# EAGLE design controller (EAGLE 4.11)
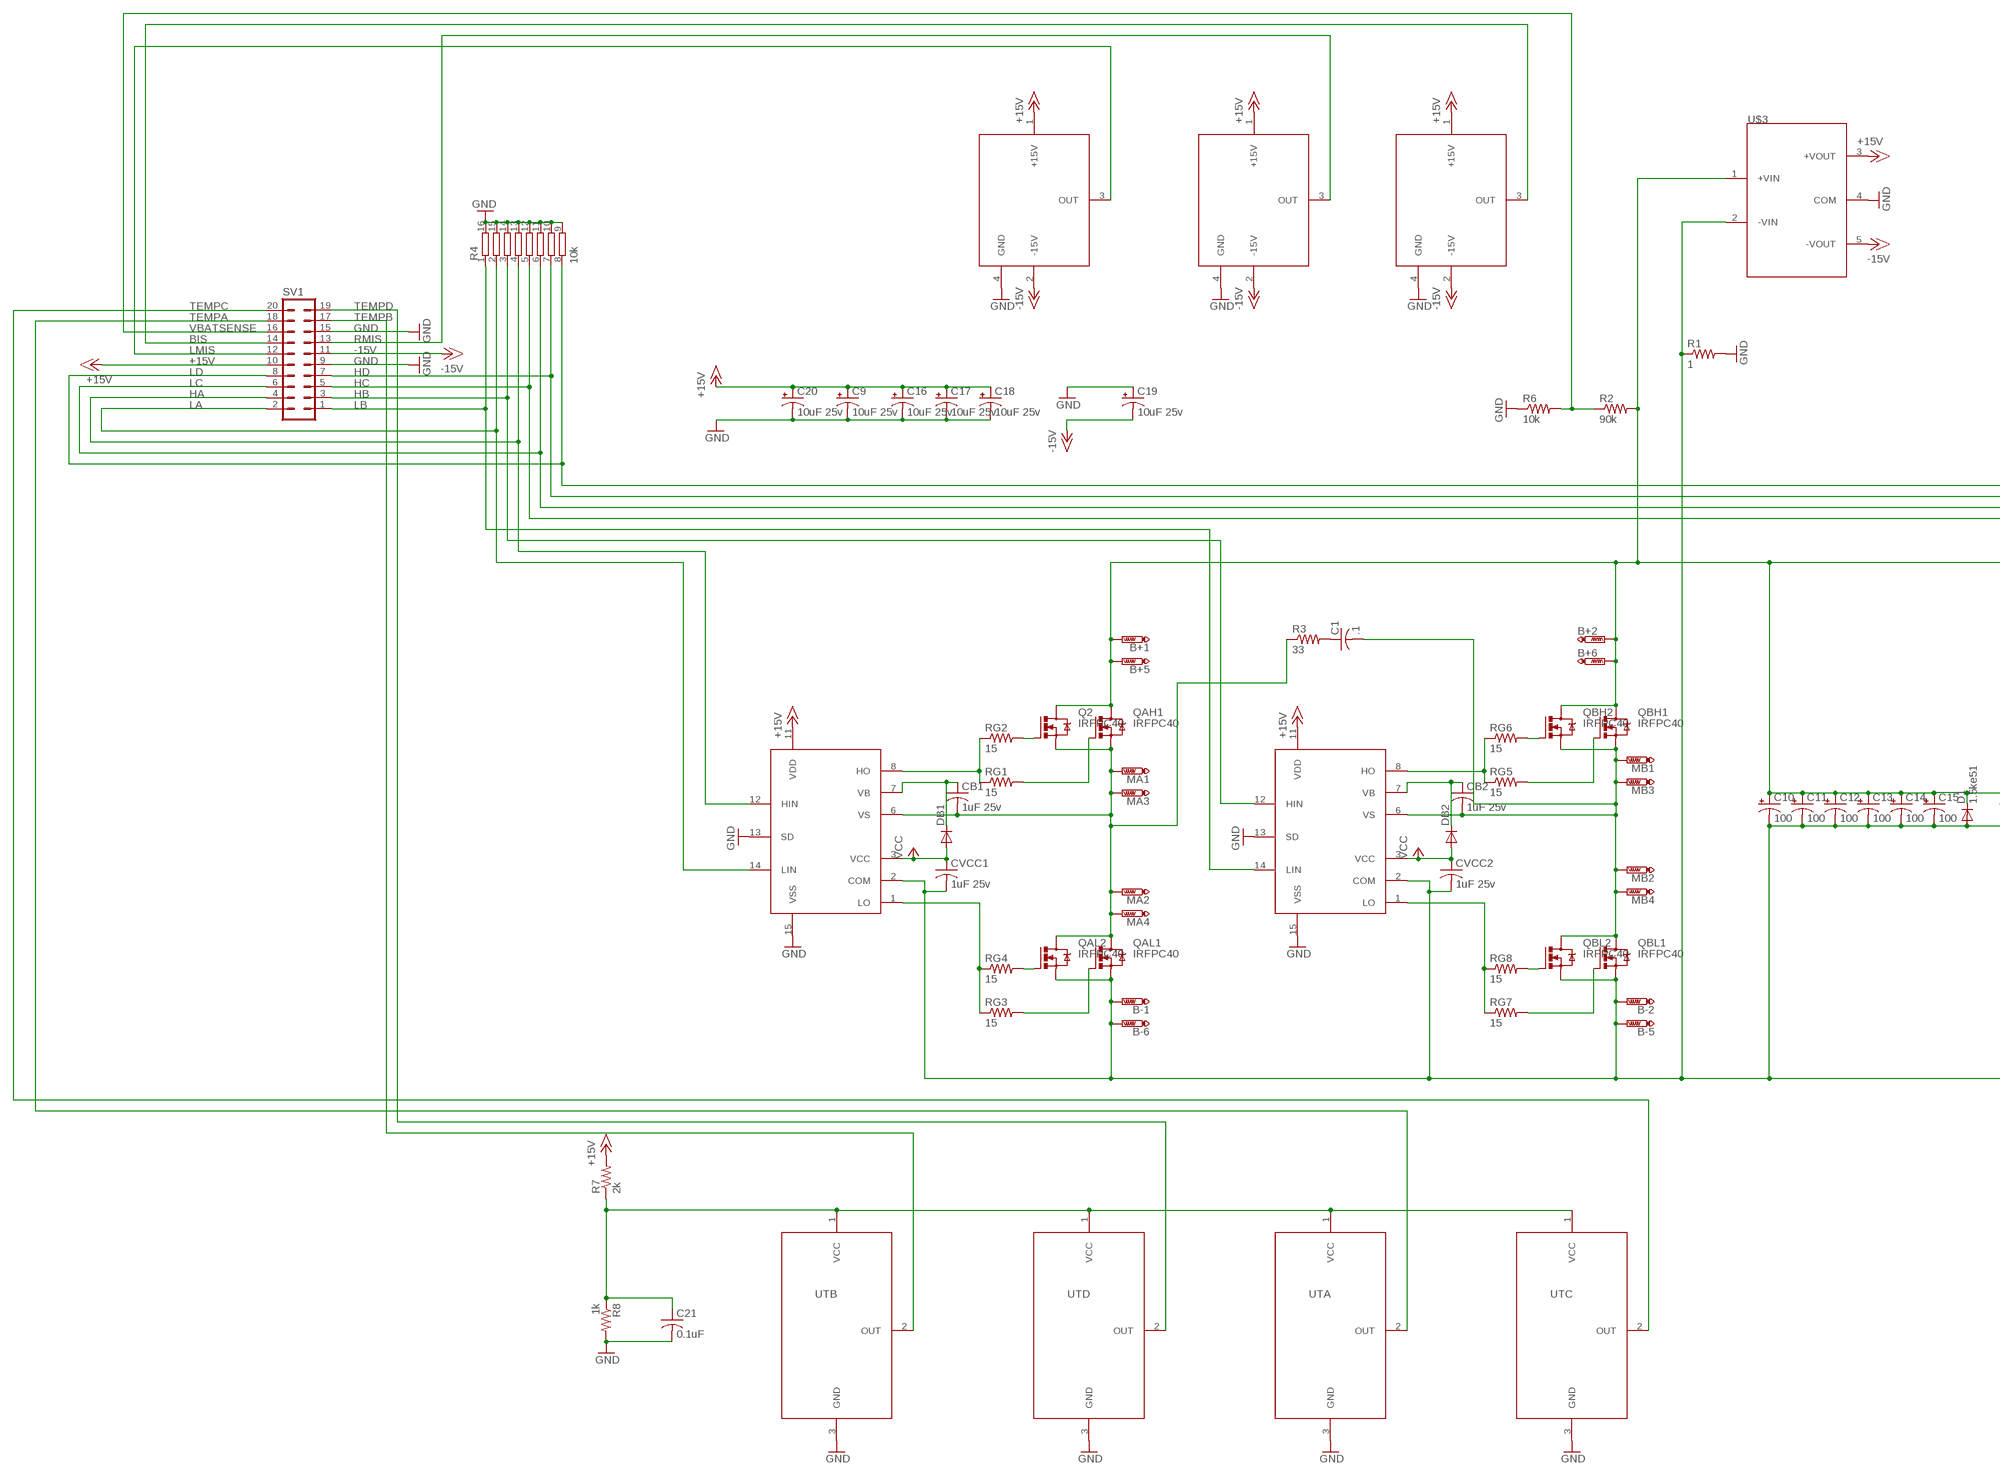
[diagram p0: schematic, sheet 1, part 1 of 2]
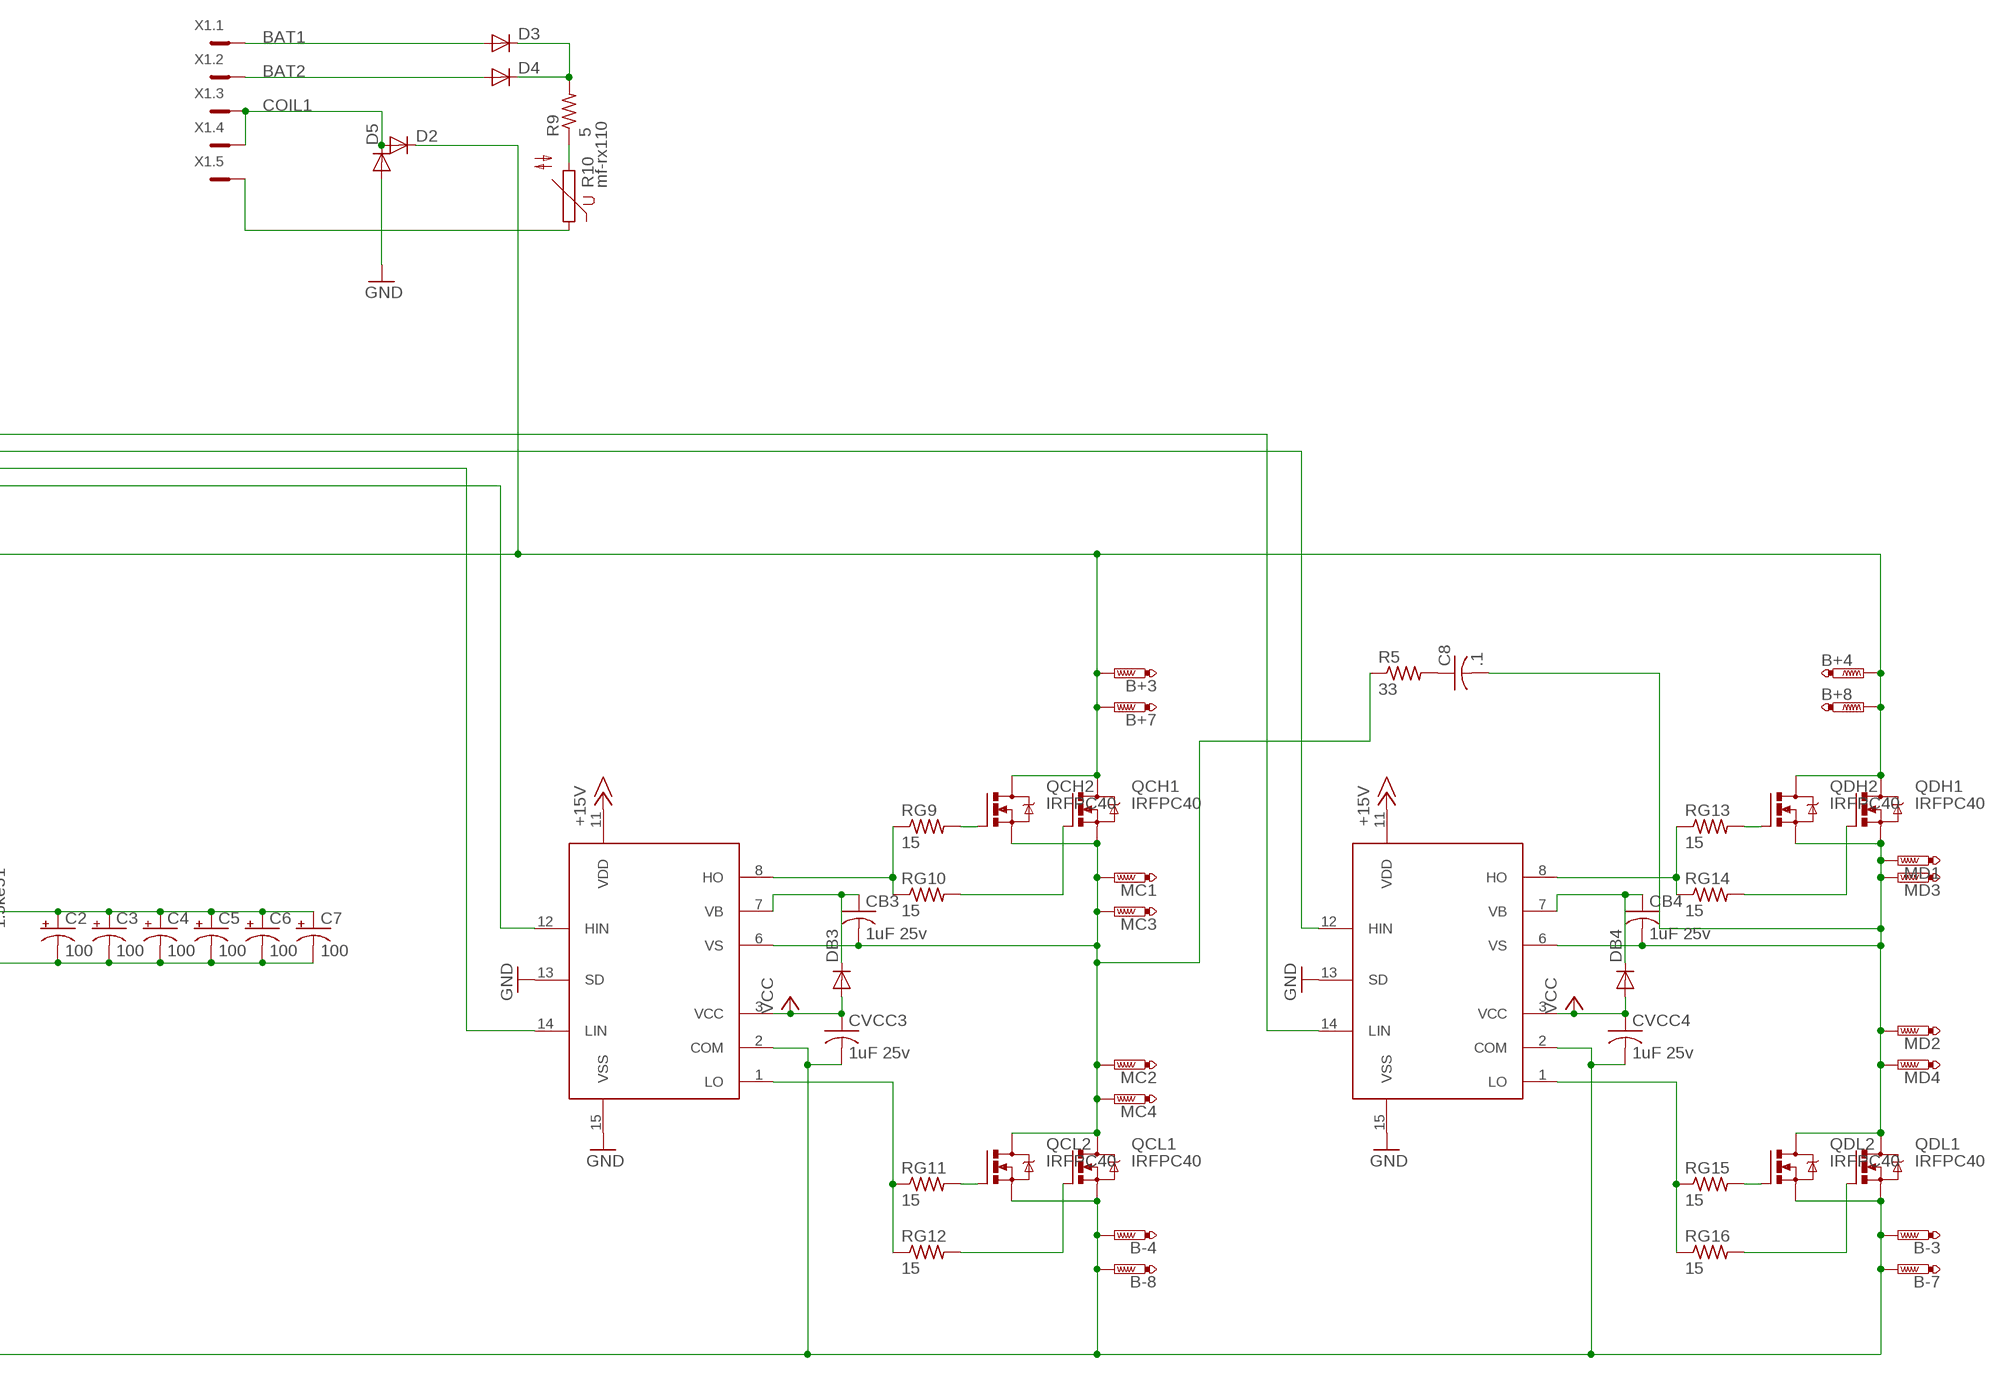
[diagram p1: schematic, sheet 1, part 2 of 2]

## Parts
B+1  PTR1PAD1-20Y  [P1-20Y]
B+2  PTR1PAD1-20Y  [P1-20Y]
B+3  PTR1PAD1-20Y  [P1-20Y]
B+4  PTR1PAD1-20Y  [P1-20Y]
B+5  PTR1PAD1-20Y  [P1-20Y]
B+6  PTR1PAD1-20Y  [P1-20Y]
B+7  PTR1PAD1-20Y  [P1-20Y]
B+8  PTR1PAD1-20Y  [P1-20Y]
B-1  PTR1PAD1-20Y  [P1-20Y]
B-2  PTR1PAD1-20Y  [P1-20Y]
B-3  PTR1PAD1-20Y  [P1-20Y]
B-4  PTR1PAD1-20Y  [P1-20Y]
B-5  PTR1PAD1-20Y  [P1-20Y]
B-6  PTR1PAD1-20Y  [P1-20Y]
B-7  PTR1PAD1-20Y  [P1-20Y]
B-8  PTR1PAD1-20Y  [P1-20Y]
C1  .1  C-US050-050X075  [C050-050X075]
C2  100  CPOL-USE2.5-7  [E2,5-7]
C3  100  CPOL-USE2.5-7  [E2,5-7]
C4  100  CPOL-USE2.5-7  [E2,5-7]
C5  100  CPOL-USE2.5-7  [E2,5-7]
C6  100  CPOL-USE2.5-7  [E2,5-7]
C7  100  CPOL-USE2.5-7  [E2,5-7]
C8  .1  C-US050-050X075  [C050-050X075]
C9  10uF 25v  CPOL-USC/6032-28R  [C/6032-28R]
C10  100  CPOL-USE2.5-7  [E2,5-7]
C11  100  CPOL-USE2.5-7  [E2,5-7]
C12  100  CPOL-USE2.5-7  [E2,5-7]
C13  100  CPOL-USE2.5-7  [E2,5-7]
C14  100  CPOL-USE2.5-7  [E2,5-7]
C15  100  CPOL-USE2.5-7  [E2,5-7]
C16  10uF 25v  CPOL-USC/6032-28R  [C/6032-28R]
C17  10uF 25v  CPOL-USC/6032-28R  [C/6032-28R]
C18  10uF 25v  CPOL-USC/6032-28R  [C/6032-28R]
C19  10uF 25v  CPOL-USC/6032-28R  [C/6032-28R]
C20  10uF 25v  CPOL-USC/6032-28R  [C/6032-28R]
C21  0.1uF  C-USC0805  [C0805]
CB1  1uF 25v  C-USC0805  [C0805]
CB2  1uF 25v  C-USC0805  [C0805]
CB3  1uF 25v  C-USC0805  [C0805]
CB4  1uF 25v  C-USC0805  [C0805]
CVCC1  1uF 25v  C-USC0805  [C0805]
CVCC2  1uF 25v  C-USC0805  [C0805]
CVCC3  1uF 25v  C-USC0805  [C0805]
CVCC4  1uF 25v  C-USC0805  [C0805]
D1  1.5ke51  DIODE-DO201-15  [DO201-15]
D2  DIODE-DO41-10  [DO41-10]
D3  DIODE-DO41-10  [DO41-10]
D4  DIODE-DO41-10  [DO41-10]
D5  DIODE-DO41-10  [DO41-10]
DB1  DIODE-SOD323-W  [SOD323-W]
DB2  DIODE-SOD323-W  [SOD323-W]
DB3  DIODE-SOD323-W  [SOD323-W]
DB4  DIODE-SOD323-W  [SOD323-W]
DRV1  IR2110S  [SO16W]
DRV2  IR2110S  [SO16W]
DRV3  IR2110S  [SO16W]
DRV4  IR2110S  [SO16W]
MA1  PTR1PAD1-20Y  [P1-20Y]
MA2  PTR1PAD1-20Y  [P1-20Y]
MA3  PTR1PAD1-20Y  [P1-20Y]
MA4  PTR1PAD1-20Y  [P1-20Y]
MB1  PTR1PAD1-20Y  [P1-20Y]
MB2  PTR1PAD1-20Y  [P1-20Y]
MB3  PTR1PAD1-20Y  [P1-20Y]
MB4  PTR1PAD1-20Y  [P1-20Y]
MC1  PTR1PAD1-20Y  [P1-20Y]
MC2  PTR1PAD1-20Y  [P1-20Y]
MC3  PTR1PAD1-20Y  [P1-20Y]
MC4  PTR1PAD1-20Y  [P1-20Y]
MD1  PTR1PAD1-20Y  [P1-20Y]
MD2  PTR1PAD1-20Y  [P1-20Y]
MD3  PTR1PAD1-20Y  [P1-20Y]
MD4  PTR1PAD1-20Y  [P1-20Y]
Q2  IRFPC40  [TO247BV]
QAH1  IRFPC40  [TO247BV]
QAL1  IRFPC40  [TO247BV]
QAL2  IRFPC40  [TO247BV]
QBH1  IRFPC40  [TO247BV]
QBH2  IRFPC40  [TO247BV]
QBL1  IRFPC40  [TO247BV]
QBL2  IRFPC40  [TO247BV]
QCH1  IRFPC40  [TO247BV]
QCH2  IRFPC40  [TO247BV]
QCL1  IRFPC40  [TO247BV]
QCL2  IRFPC40  [TO247BV]
QDH1  IRFPC40  [TO247BV]
QDH2  IRFPC40  [TO247BV]
QDL1  IRFPC40  [TO247BV]
QDL2  IRFPC40  [TO247BV]
R1  1  R-US_R1206  [R1206]
R2  90k  R-US_R0805  [R0805]
R3  33  R-US_0207/12  [0207/12]
R4  10k  4816P-T01  [4816P]
R5  33  R-US_0207/12  [0207/12]
R6  10k  R-US_R0805  [R0805]
R7  2k  R-US_R0805  [R0805]
R8  1k  R-US_R0805  [R0805]
R9  5  R-US_0617/17  [0617/17]
R10  mf-rx110  S05K40  [S05K40]
RG1  15  R-US_R0805  [R0805]
RG2  15  R-US_R0805  [R0805]
RG3  15  R-US_R0805  [R0805]
RG4  15  R-US_R0805  [R0805]
RG5  15  R-US_R0805  [R0805]
RG6  15  R-US_R0805  [R0805]
RG7  15  R-US_R0805  [R0805]
RG8  15  R-US_R0805  [R0805]
RG9  15  R-US_R0805  [R0805]
RG10  15  R-US_R0805  [R0805]
RG11  15  R-US_R0805  [R0805]
RG12  15  R-US_R0805  [R0805]
RG13  15  R-US_R0805  [R0805]
RG14  15  R-US_R0805  [R0805]
RG15  15  R-US_R0805  [R0805]
RG16  15  R-US_R0805  [R0805]
SV1  MA10-2  [MA10-2]
U$1  L08P150D15  [L08P]
U$2  L08P150D15  [L08P]
U$3  DFC10U48D15  [DFC10]
U$5  L08P150D15  [L08P]
UTA  LM61BIM  [SOT23]
UTB  LM61BIM  [SOT23]
UTC  LM61BIM  [SOT23]
UTD  LM61BIM  [SOT23]
X1  MC5  [MC5]

## Nets
+15V: C9.+ C16.+ C17.+ C18.+ C20.+ DRV1.11(VDD) DRV2.11(VDD) DRV3.11(VDD) DRV4.11(VDD) R7.2 SV1.10 U$1.1(+15V) U$2.1(+15V) U$3.3(+VOUT) U$5.1(+15V)
-15V: C19.- SV1.11 U$1.2(-15V) U$2.2(-15V) U$3.5(-VOUT) U$5.2(-15V)
B+ [highpwr]: B+1.1(TP) B+2.1(TP) B+3.1(TP) B+4.1(TP) B+5.1(TP) B+6.1(TP) B+7.1(TP) B+8.1(TP) C2.+ C3.+ C4.+ C5.+ C6.+ C7.+ C10.+ C11.+ C12.+ C13.+ C14.+ C15.+ D1.C D2.C Q2.D QAH1.D QBH1.D QBH2.D QCH1.D QCH2.D QDH1.D QDH2.D R2.2 U$3.1(+VIN)
B- [highpwr]: B-1.1(TP) B-2.1(TP) B-3.1(TP) B-4.1(TP) B-5.1(TP) B-6.1(TP) B-7.1(TP) B-8.1(TP) C2.- C3.- C4.- C5.- C6.- C7.- C10.- C11.- C12.- C13.- C14.- C15.- CVCC1.2 CVCC2.2 CVCC3.2 CVCC4.2 D1.A DRV1.2(COM) DRV2.2(COM) DRV3.2(COM) DRV4.2(COM) QAL1.S QAL2.S QBL1.S QBL2.S QCL1.S QCL2.S QDL1.S QDL2.S R1.1 U$3.2(-VIN)
BAT1 [highsig]: D3.A X1.1
BAT2 [highsig]: D4.A X1.2
BIS: SV1.14 U$5.3(OUT)
COIL1 [highsig]: D2.A D5.C X1.3 X1.4
GAH [highsig]: DRV1.8(HO) RG1.1 RG2.1
GAH1 [highsig]: DRV3.8(HO) RG9.1 RG10.1
GAL [highsig]: DRV1.1(LO) RG3.1 RG4.1
GAL1 [highsig]: DRV3.1(LO) RG11.1 RG12.1
GBH [highsig]: DRV2.8(HO) RG5.1 RG6.1
GBH1 [highsig]: DRV4.8(HO) RG13.1 RG14.1
GBL [highsig]: DRV2.1(LO) RG7.1 RG8.1
GBL1 [highsig]: DRV4.1(LO) RG15.1 RG16.1
GND [pwr]: C9.- C16.- C17.- C18.- C19.+ C20.- C21.2 D5.A DRV1.13(SD) DRV1.15(VSS) DRV2.13(SD) DRV2.15(VSS) DRV3.13(SD) DRV3.15(VSS) DRV4.13(SD) DRV4.15(VSS) R1.2 R4.9 R4.10 R4.11 R4.12 R4.13 R4.14 R4.15 R4.16 R6.1 R8.2 SV1.9 SV1.15 U$1.4(GND) U$2.4(GND) U$3.4(COM) U$5.4(GND) UTA.3(GND) UTB.3(GND) UTC.3(GND) UTD.3(GND)
HA: DRV1.12(HIN) R4.4 SV1.4
HB: DRV2.12(HIN) R4.3 SV1.3
HC: DRV3.12(HIN) R4.5 SV1.5
HD: DRV4.12(HIN) R4.7 SV1.7
LA: DRV1.14(LIN) R4.2 SV1.2
LB: DRV2.14(LIN) R4.1 SV1.1
LC: DRV3.14(LIN) R4.6 SV1.6
LD: DRV4.14(LIN) R4.8 SV1.8
LMIS: SV1.12 U$1.3(OUT)
MA1 [highpwr]: CB3.2 DRV3.6(VS) MC1.1(TP) MC2.1(TP) MC3.1(TP) MC4.1(TP) QCH1.S QCH2.S QCL1.D QCL2.D R5.1
MB [highpwr]: C1.2 CB2.2 DRV2.6(VS) MB1.1(TP) MB2.1(TP) MB3.1(TP) MB4.1(TP) QBH1.S QBH2.S QBL1.D QBL2.D
MB1 [highpwr]: C8.2 CB4.2 DRV4.6(VS) MD1.1(TP) MD2.1(TP) MD3.1(TP) MD4.1(TP) QDH1.S QDH2.S QDL1.D QDL2.D
N$1 [pwr]: CB3.1 DB3.C DRV3.7(VB)
N$2: C1.1 R3.2
N$3 [pwr]: CB4.1 DB4.C DRV4.7(VB)
N$4: C8.1 R5.2
N$5 [pwr]: CB1.1 DB1.C DRV1.7(VB)
N$6: C21.1 R7.1 R8.1 UTA.1(VCC) UTB.1(VCC) UTC.1(VCC) UTD.1(VCC)
N$7 [highsig]: R9.1 R10.2
N$8 [highsig]: D3.C D4.C R9.2
N$9 [pwr]: CB2.1 DB2.C DRV2.7(VB)
N$10: R10.1 X1.5
Q1G [highsig]: QAH1.G RG1.2
Q1G1 [highsig]: QCH1.G RG10.2
Q2G [highsig]: Q2.G RG2.2
Q2G1 [highsig]: QCH2.G RG9.2
Q3G [highsig]: QAL1.G RG3.2
Q3G1 [highsig]: QCL1.G RG12.2
Q4G [highsig]: QAL2.G RG4.2
Q4G1 [highsig]: QCL2.G RG11.2
Q5G [highsig]: QBH1.G RG5.2
Q5G1 [highsig]: QDH1.G RG14.2
Q6G [highsig]: QBH2.G RG6.2
Q6G1 [highsig]: QDH2.G RG13.2
Q7G [highsig]: QBL1.G RG7.2
Q7G1 [highsig]: QDL1.G RG16.2
Q8G [highsig]: QBL2.G RG8.2
Q8G1 [highsig]: QDL2.G RG15.2
QAH2: CB1.2 DRV1.6(VS) MA1.1(TP) MA2.1(TP) MA3.1(TP) MA4.1(TP) Q2.S QAH1.S QAL1.D QAL2.D R3.1
RMIS: SV1.13 U$2.3(OUT)
TEMPA: SV1.18 UTA.2(OUT)
TEMPB: SV1.17 UTB.2(OUT)
TEMPC: SV1.20 UTC.2(OUT)
TEMPD: SV1.19 UTD.2(OUT)
VBATSENSE: R2.1 R6.2 SV1.16
VCC [pwr]: CVCC1.1 CVCC2.1 CVCC3.1 CVCC4.1 DB1.A DB2.A DB3.A DB4.A DRV1.3(VCC) DRV2.3(VCC) DRV3.3(VCC) DRV4.3(VCC)

## Library data of the parts
B+1-B+8 B-1-B-8 MA1-MA4 MB1-MB4 MC1-MC4 MD1-MD4 = testpad:PTR1: TEST PIN
C1 C8 C21 CB1-CB4 CVCC1-CVCC4 = rcl:C-US: CAPACITOR, American symbol
C2-C7 C9-C20 = rcl:CPOL-US: POLARIZED CAPACITOR, American symbol
D1-D5 DB1-DB4 = diode:DIODE-: DIODE
DRV1-DRV4 = tlb:IR2110S
Q2 QAH1 QAL1 QAL2 QBH1 QBH2 QBL1 QBL2 QCH1 QCH2 QCL1 QCL2 QDH1 QDH2 QDL1 QDL2 = transistor-power:IRFPC40: N-CHANNEL MOS FET
R1-R3 R5-R9 RG1-RG16 = rcl:R-US_: RESISTOR, American symbol
R4 = resistor-bourns:4816P-T01: BOURNS RESISTOR NETWORK
R10 = varistor:S05K40: VARISTOR
SV1 = con-lstb:MA10-2: PIN HEADER
U$1 U$2 U$5 = tlb:L08P150D15
U$3 = tlb:DFC10U48D15
UTA UTB UTC UTD = tlb:LM61BIM
X1 = con-phoenix-381_l:MC5: Mini-Combicon 3.81mm horizontal 5-polig (ohne Gegenstecker)

## Net classes
0 default: width 0.203 mm
1 highpwr: width 0.61 mm, clearance 0.813 mm
2 highsig: width 0.406 mm, clearance 0.61 mm
3 pwr: width 0.61 mm, clearance 0.61 mm

## Board
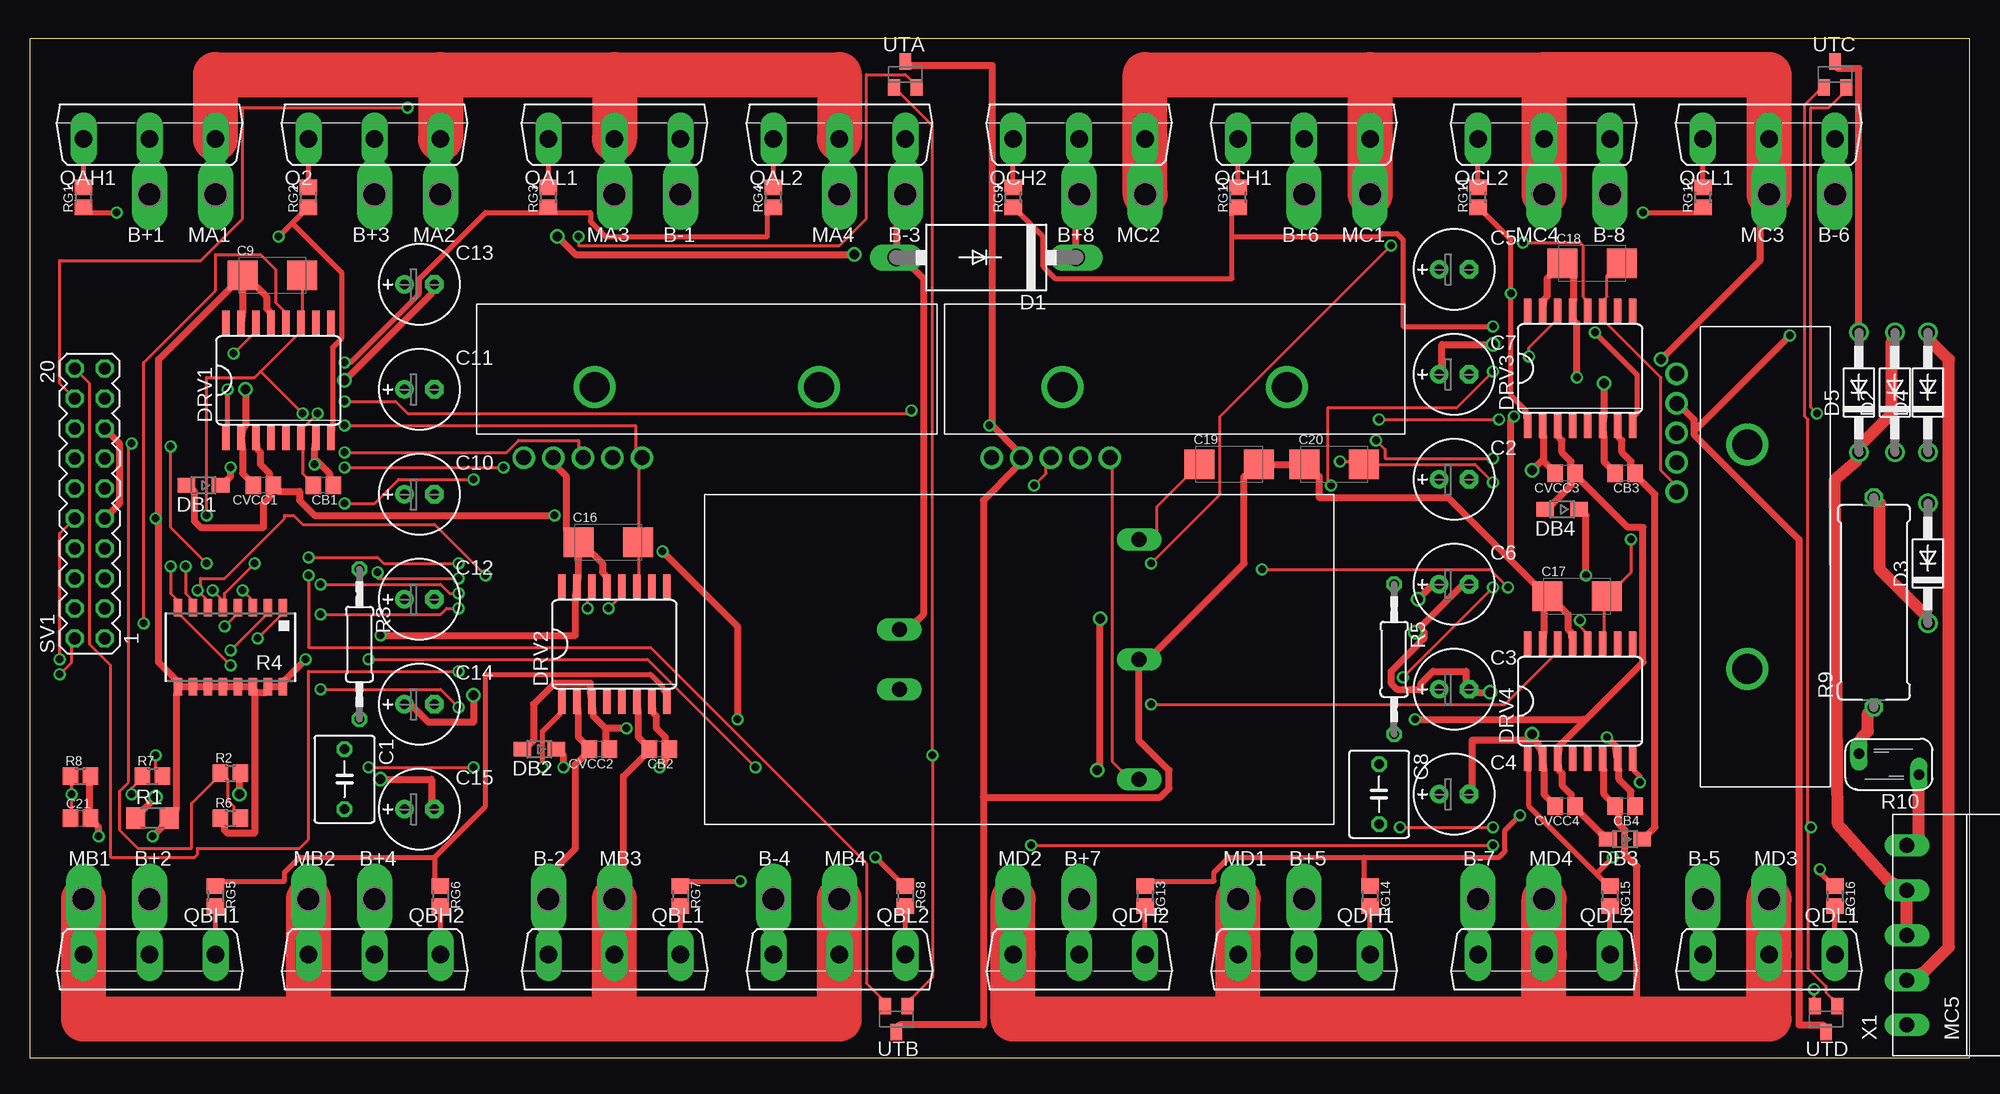
[diagram p2: board, top side]
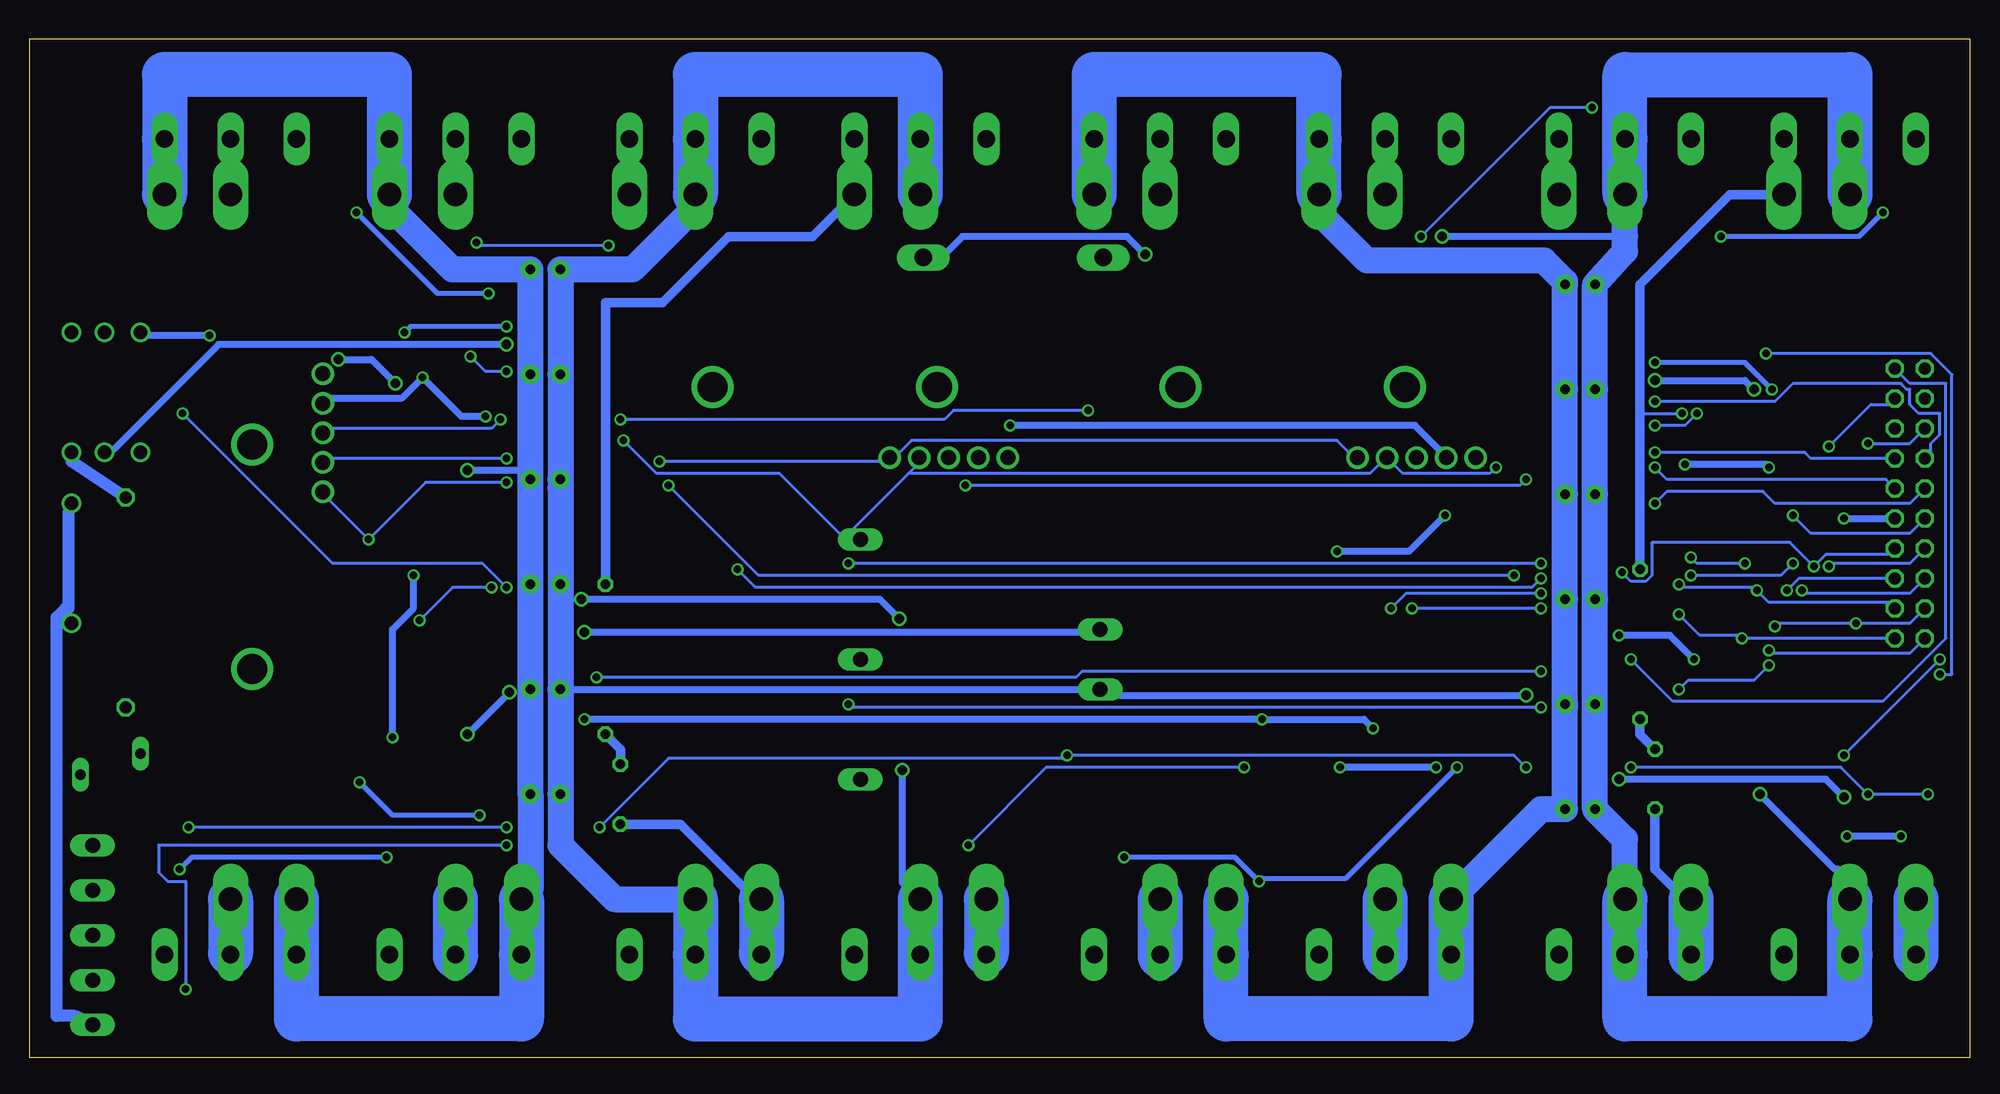
[diagram p3: board, bottom side, seen from below]

Size 164.34 x 86.36 mm. Coordinates in mm from the lower left corner, seen from the top.
Outline: 0,0 164.34,0 164.34,86.36 0,86.36 0,0
Copper layers (1*16): Top 0.035mm / dielectric 1.5mm / Bottom 0.035mm
Design rules "default": minimum track width 10mil, minimum drill 24mil, track to track 8mil, track to pad 8mil, pad to pad 8mil, via to via 8mil, smd to smd 8mil, copper to edge 40mil, drill to drill 8mil, minimum pad ring 10mil, minimum via ring 8mil, stop-mask expansion 4mil, vias tented up to drill 0mil, thermal gap 10mil

### Footprints (pad centres in the part's own frame; a part is rotated, then mirrored left to right if it is on the bottom)
P1-20Y = drill 2.007 pad 2.54 long: 1 0,0
C050-050X075 = drill 0.813 octagon: 1 -2.54,0; 2 2.54,0
E2,5-7 = drill 0.813 pad 1.6 round: + -1.27,0 | drill 0.813 pad 1.6 octagon: - 1.27,0
C/6032-28R = smd 2.55 x 2.5: + 2.525,0; - -2.525,0
C0805 = smd 1.3 x 1.5: 1 -0.85,0; 2 0.85,0
DO201-15 = drill 1.499 long: A 7.62,0; C -7.62,0
DO41-10 = drill 1.118 round: A 5.08,0; C -5.08,0
SOD323-W = smd 1.5 x 1.2: A 1.45,0; C -1.45,0
SO16W = smd 0.66 x 2.032: 1 -3.175,-6.172; 2 -1.905,-6.172; 3 -0.635,-6.172; 4 0.635,-6.172; 5 1.905,-6.172; 6 3.175,-6.172; 7 4.445,-6.172; 8 5.715,-6.172; 9 5.715,3.632; 10 4.445,3.632; 11 3.175,3.632; 12 1.905,3.632; 13 0.635,3.632; 14 -0.635,3.632; 15 -1.905,3.632; 16 -3.175,3.632
TO247BV = drill 1.499 long: D 0,-2.921; G -5.588,-2.921; S 5.588,-2.921
R1206 = smd 1.6 x 1.803: 1 -1.422,0; 2 1.422,0
R0805 = smd 1.3 x 1.5: 1 -0.85,0; 2 0.85,0
0207/12 = drill 0.813 octagon: 1 -6.35,0; 2 6.35,0
4816P = smd 0.7 x 1.5: 1 -4.445,-3.346; 2 -3.175,-3.346; 3 -1.905,-3.346; 4 -0.635,-3.346; 5 0.635,-3.346; 6 1.905,-3.346; 7 3.175,-3.346; 8 4.445,-3.346; 9 4.445,3.346; 10 3.175,3.346; 11 1.905,3.346; 12 0.635,3.346; 13 -0.635,3.346; 14 -1.905,3.346; 15 -3.175,3.346; 16 -4.445,3.346
0617/17 = drill 1.016 octagon: 1 -8.89,0; 2 8.89,0
S05K40 = drill 0.914 long: 1 -0.889,-2.54; 2 0.889,2.54
MA10-2 = drill 1.016 octagon: 1 -11.43,-1.27; 2 -11.43,1.27; 3 -8.89,-1.27; 4 -8.89,1.27; 5 -6.35,-1.27; 6 -6.35,1.27; 7 -3.81,-1.27; 8 -3.81,1.27; 9 -1.27,-1.27; 10 -1.27,1.27; 11 1.27,-1.27; 12 1.27,1.27; 13 3.81,-1.27; 14 3.81,1.27; 15 6.35,-1.27; 16 6.35,1.27; 17 8.89,-1.27; 18 8.89,1.27; 19 11.43,-1.27; 20 11.43,1.27
L08P = drill 1.27 round: 1 -3,-3; 2 -5.5,-3; 3 -8,-3; 4 -10.5,-3; 5 -13,-3 | drill 2.54 round: P$6 -7,3; P$7 12,3
DFC10 = drill 1.27 long: 1 0,-2.54; 2 0,2.54; 3 20.32,-10.16; 4 20.32,0; 5 20.32,10.16
SOT23 = smd 1 x 1.4: 1 -0.95,-1.1; 2 0.95,-1.1; 3 0,1.1
MC5 = drill 1.27 long: 1 -7.62,0; 2 -3.81,0; 3 0,0; 4 3.81,0; 5 7.62,0

### Placement (x,y rotation side)
B+1  10.16,73.15 180 top
B+2  10.16,13.46 0 top
B+3  29.21,73.15 180 top
B+4  29.21,13.46 0 top
B+5  107.95,13.46 0 top
B+6  107.95,73.15 180 top
B+7  88.9,13.46 0 top
B+8  88.9,73.15 180 top
B-1  55.12,73.15 180 top
B-2  43.94,13.46 0 top
B-3  74.17,73.15 180 top
B-4  62.99,13.46 0 top
B-5  141.73,13.46 0 top
B-6  152.91,73.15 180 top
B-7  122.68,13.46 0 top
B-8  133.86,73.15 180 top
C1  26.67,23.62 270 top
C2  120.65,49.02 0 top
C3  120.65,31.24 0 top
C4  120.65,22.35 0 top
C5  120.65,66.8 0 top
C6  120.65,40.13 0 top
C7  120.65,57.91 0 top
C8  114.3,22.35 270 top
C9  20.57,66.29 0 top
C10  33.02,47.75 0 top
C11  33.02,56.64 0 top
C12  33.02,38.86 0 top
C13  33.02,65.53 0 top
C14  33.02,29.97 0 top
C15  33.02,21.08 0 top
C16  49.02,43.69 0 top
C17  131.06,39.12 0 top
C18  132.33,67.31 0 top
C19  101.6,50.29 0 top
C20  110.49,50.29 0 top
C21  4.32,20.32 0 top
CB1  24.89,48.51 180 top
CB2  53.34,26.16 180 top
CB3  135.13,49.53 180 top
CB4  135.13,21.34 180 top
CVCC1  19.81,48.51 180 top
CVCC2  48.26,26.16 180 top
CVCC3  130.05,49.53 180 top
CVCC4  130.05,21.34 180 top
D1  81.03,67.82 180 top
D2  157.99,56.39 90 top
D3  160.78,41.91 90 top
D4  160.78,56.39 90 top
D5  154.94,56.39 90 top
DB1  14.73,48.51 180 top
DB2  43.18,26.16 180 top
DB3  135.13,18.54 180 top
DB4  129.79,46.48 180 top
DRV1  19.81,58.67 0 top
DRV2  48.26,36.32 0 top
DRV3  130.05,59.69 0 top
DRV4  130.05,31.5 0 top
MA1  15.75,73.15 180 top
MA2  34.8,73.15 180 top
MA3  49.53,73.15 180 top
MA4  68.58,73.15 180 top
MB1  4.57,13.46 0 top
MB2  23.62,13.46 0 top
MB3  49.53,13.46 0 top
MB4  68.58,13.46 0 top
MC1  113.54,73.15 180 top
MC2  94.49,73.15 180 top
MC3  147.32,73.15 180 top
MC4  128.27,73.15 180 top
MD1  102.36,13.46 0 top
MD2  83.31,13.46 0 top
MD3  147.32,13.46 0 top
MD4  128.27,13.46 0 top
Q2  29.21,80.77 0 top
QAH1  10.16,80.77 0 top
QAL1  49.53,80.77 0 top
QAL2  68.58,80.77 0 top
QBH1  10.16,5.84 180 top
QBH2  29.21,5.84 180 top
QBL1  49.53,5.84 180 top
QBL2  68.58,5.84 180 top
QCH1  107.95,80.77 0 top
QCH2  88.9,80.77 0 top
QCL1  147.32,80.77 0 top
QCL2  128.27,80.77 0 top
QDH1  107.95,5.84 180 top
QDH2  88.9,5.84 180 top
QDL1  147.32,5.84 180 top
QDL2  128.27,5.84 180 top
R1  10.41,20.32 0 top
R2  17.02,24.13 0 top
R3  27.94,35.05 270 top
R4  17.02,34.8 180 top
R5  115.57,33.78 270 top
R6  17.02,20.32 0 top
R7  10.41,23.88 0 top
R8  4.32,23.88 0 top
R9  156.21,38.61 90 top
R10  157.48,24.89 90 top
RG1  4.57,72.9 90 top
RG2  23.62,72.9 90 top
RG3  43.94,72.9 90 top
RG4  62.99,72.9 90 top
RG5  15.75,13.72 270 top
RG6  34.8,13.72 270 top
RG7  55.12,13.72 270 top
RG8  74.17,13.72 270 top
RG9  83.31,72.9 90 top
RG10  102.36,72.9 90 top
RG11  122.68,72.9 90 top
RG12  141.73,72.9 90 top
RG13  94.49,13.72 270 top
RG14  113.54,13.72 270 top
RG15  133.86,13.72 270 top
RG16  152.91,13.72 270 top
SV1  5.08,46.99 90 top
U$1  94.49,53.85 0 top
U$2  54.86,53.85 0 top
U$3  73.66,33.78 0 top
U$5  142.49,44.96 270 top
UTA  74.17,83.31 0 top
UTB  73.41,3.3 180 top
UTC  152.91,83.31 0 top
UTD  152.15,3.3 180 top
X1  159,10.41 90 top

### Tracks (layer width: path | path; a pad name or v marks a point on that pad's centre or on a via)
+15V  (via drill 0.61)
  Top 0.254: C9.+ 23.11,65.28 23.11,63.25 DRV1.11 22.86,61.47 19.56,58.17 | v10.67,25.65 10.67,24.38 R7.2 | v2.54,33.78 2.54,44.45 SV1.10 | 19.56,58.17 19.05,57.66 14.99,57.66 v14.99,45.97 | C18.+ 133.6,66.29 133.6,64.52 133.35,64.26 DRV3.11 133.35,62.48 138.18,57.66 138.18,49.78 139.19,48.77 U$5.1 | DRV4.11 133.35,36.07 133.35,38.1 C17.+ 134.62,40.13 135.64,41.15 v135.64,43.94 | DRV2.11 51.56,40.89 51.56,42.67 C16.+ 51.56,44.7 51.56,50.04 U$2.1 51.31,51.56 51.31,53.59 v26.67,53.59 | v111,50.55 111.76,50.55 C20.+ 122.43,50.29 v123.95,48.77 | U$3.3 92.46,24.38 91.69,25.15 91.69,50.04 U$1.1 | 19.56,58.17 v23.11,54.61
  Bottom 0.254: v10.67,25.65 v2.54,33.78 | v14.99,45.97 13.46,44.45 5.08,44.45 SV1.10 | U$5.1 138.94,47.24 v135.64,43.94 130.81,48.77 v123.95,48.77 | v111,50.55 92.2,50.55 U$1.1 90.68,51.31 89.66,52.32 53.59,52.32 52.58,51.31 U$2.1 | v23.11,54.61 24.13,53.59 v26.67,53.59
-15V  (via drill 0.61)
  Top 0.254: v26.67,50.04 v40.13,50.04 | C19.- 98.04,49.28 95.5,46.74 95.5,44.7 U$3.5 | v123.95,50.8 114.81,50.8 114.81,51.56 v114.05,52.32
  Bottom 0.254: v26.67,50.04 25.65,49.02 7.11,49.02 SV1.11 | v40.13,50.04 40.64,49.53 48.01,49.53 48.77,50.29 U$2.2 50.04,50.29 50.8,49.53 89.92,49.53 | 89.92,49.53 94.74,44.7 U$3.5 95.76,44.45 100.84,49.53 111.25,49.53 v114.05,52.32 | 89.92,49.53 89.41,50.04 U$1.2 | v123.95,50.8 138.68,50.8 U$5.2
B+  (via drill 0.81)
  Top 0.61: v17.78,22.35 17.78,23.62 R2.2 | v123.95,60.45 119.63,60.45 119.63,58.67 C7.+ | D1.C 88.65,70.36 B+8.1 | v37.59,30.73 37.59,28.45 33.78,28.45 32.51,29.72 C14.+ | v44.7,69.6 46.23,68.07 v69.85,68.07 | v90.42,24.38 90.68,24.64 v90.68,37.21 | v117.6,38.86 118.62,39.88 C6.+
  Bottom 0.61: v17.78,22.35 11.43,16 11.18,16 B+2.1 | v123.95,60.45 148.34,60.45 157.23,51.56 D2.C | C3.+ U$3.1 71.88,30.73 v37.59,30.73 | v69.85,68.07 71.37,69.6 85.34,69.6 86.61,68.33 D1.C | 29.21,69.6 v44.7,69.6 | v90.42,24.38 90.42,14.86 90.3,14.73 B+7.1 | v90.68,37.21 92.33,38.86 v117.6,38.86
  Bottom 2.184: B+3.1 29.21,69.6 29.21,68.33 C13.+ C11.+ | C12.+ C15.+ 29.21,18.54 B+4.1 | C12.+ C10.+ | C10.+ C11.+ | C5.+ 113.28,66.8 107.95,72.14 B+6.1 | B+5.1 114.81,13.46 119.38,18.03 C4.+ C3.+ 119.38,48.26 C2.+ C7.+ | C5.+ C7.+ | C5.+ C7.+ | C10.+ C11.+ | C12.+ C10.+
  Bottom 3.81: B+1.1 QAH1.D 10.16,83.31 29.21,83.31 Q2.D B+3.1 | B+5.1 QDH1.D 107.95,3.3 88.9,3.3 QDH2.D B+7.1 | B+2.1 QBH1.D 10.16,3.3 29.21,3.3 QBH2.D B+4.1 | B+6.1 QCH1.D 107.95,83.31 88.9,83.31 QCH2.D B+8.1
B-  (via drill 0.81)
  Top 0.61: 128.27,50.55 128.78,50.04 CVCC3.2 | 128.27,50.55 128.27,52.58 DRV3.2 | CVCC4.2 128.78,21.84 128.27,22.35 128.27,24.38 DRV4.2 128.02,26.16 127.76,26.42 127.76,26.67 127.51,26.92 | 127.51,26.92 122.17,26.92 122.17,23.11 C4.- | v127.25,49.78 128.02,50.55 128.27,50.55 | U$3.2 75.18,37.08 75.69,37.59 75.69,66.04 74.93,66.8 D1.A 73.41,70.36 B-3.1 | DRV2.2 46.48,29.21 46.48,27.18 46.99,26.67 CVCC2.2 46.99,25.65 46.23,24.89 46.23,17.78 44.7,16.26 B-2.1 | CVCC1.2 18.54,49.02 18.03,49.53 18.03,51.56 DRV1.2 18.03,53.34 18.29,53.59 v18.29,56.64 | v10.67,22.1 9.65,21.08 R1.1 | v29.72,23.62 34.04,23.62 34.04,21.84 C15.- | v26.67,57.4 34.04,64.77 C13.- | C6.- 121.16,39.88 v117.35,36.07 117.86,36.32 118.11,36.07 118.11,35.56 115.32,32.77 115.32,31.75 115.82,31.24 117.86,31.24 117.86,31.75 118.87,32.77 121.67,32.77 121.67,32 C3.- 122.68,30.99 v123.7,30.99 | v127.25,27.43 127.51,27.18 127.51,26.92
  Bottom 0.61: 121.92,49.78 v127.25,49.78 | v10.67,22.1 12.19,23.62 v29.72,23.62 | v18.29,56.64 19.05,57.4 v26.67,57.4 | v117.35,36.07 75.44,36.07 U$3.2 | v123.7,30.99 v127.25,27.43
  Bottom 2.184: C15.- 34.29,29.72 C14.- | C14.- C12.- | C12.- C10.- | C10.- C11.- | C11.- C13.- 34.29,65.79 36.07,67.56 51.05,67.56 55.12,71.63 B-1.1 | C15.- 36.32,21.08 B-2.1 | B-7.1 121.92,14.22 C4.- C2.- | C2.- 121.92,49.78 C7.- | C7.- C5.- 128.52,66.8 133.86,72.14 B-8.1 | C2.- C7.- | C10.- C11.- | C14.- C12.- | C15.- C14.-
  Bottom 3.81: B-1.1 QAL1.S 55.12,83.31 74.17,83.31 QAL2.S B-3.1 | B-5.1 QDL1.S 141.73,3.3 122.68,3.3 QDL2.S B-7.1 | B-2.1 QBL1.S 43.94,3.3 62.99,3.3 QBL2.S B-4.1 | B-6.1 QCL1.S 152.91,83.31 133.86,83.31 QCL2.S B-8.1
BAT1
  Bottom 0.406: 161.29,38.1 161.04,38.1
  Bottom 1.016: 161.04,38.1 161.04,46.23 D3.A | 161.29,38.1 162.05,37.34 162.05,3.56 160.53,3.56 X1.1
BAT2
  Top 1.016: D4.A 161.04,60.71 162.56,59.18 162.56,9.4 160.53,7.37 X1.2
BIS  (via drill 0.61)
  Top 0.254: v26.67,55.63 30.99,55.63 32,54.61 74.68,54.61 v74.68,54.86 | v114.3,54.1 v124.46,54.1
  Bottom 0.254: v26.67,55.63 16.51,55.63 14.99,57.15 5.84,57.15 5.33,56.64 5.08,56.64 5.08,55.37 4.32,54.61 2.54,54.61 2.54,52.83 3.3,52.07 3.3,51.31 SV1.14 | v74.68,54.86 86.11,54.86 86.87,54.1 v114.3,54.1 | v124.46,54.1 125.22,53.34 138.68,53.34 U$5.3
COIL1
  Top 1.016: X1.3 X1.4 157.48,14.99 153.16,19.81 152.91,49.02 154.69,50.55 D5.C 155.19,52.07 157.73,54.61 157.73,60.71 D2.A
GAH  (via drill 0.61)
  Top 0.406: v7.37,71.63 5.08,71.63 RG1.1 | 22.22,70.74 23.11,71.63 RG2.1 | v21.08,69.6 22.22,70.74 | DRV1.8 25.65,53.34 25.65,60.2 26.42,60.96 26.42,66.55 22.22,70.74
  Bottom 0.406: v7.37,71.63 9.4,69.6 v21.08,69.6
GAH1  (via drill 0.61)
  Top 0.406: 101.85,69.6 101.85,71.63 RG10.1 | 101.85,69.6 101.85,66.04 86.87,66.04 85.85,67.06 85.85,69.6 83.82,71.63 RG9.1 | v132.59,61.47 136.14,57.91 136.14,54.61 135.89,54.36 DRV3.8 | v123.95,61.98 116.33,61.98 116.33,69.34 115.82,69.85 114.55,69.85 114.3,69.6 101.85,69.6
  Bottom 0.406: v132.59,61.47 132.08,61.98 v123.95,61.98
GAL  (via drill 0.61)
  Top 0.406: RG4.1 62.48,71.63 62.48,69.6 48.77,69.6 47.5,70.87 47.5,71.63 44.45,71.63 RG3.1 43.43,71.63 38.61,71.63 33.02,66.04 33.02,64.77 27.18,58.93 v26.67,58.93 | v16.76,56.64 16.76,53.34 DRV1.1
  Bottom 0.406: v16.76,56.64 19.05,58.93 v26.67,58.93
GAL1  (via drill 0.61)
  Top 0.406: RG11.1 123.19,71.63 125.48,69.34 v125.48,64.77 125.48,56.13 126.75,54.86 126.75,54.36 DRV3.1 | v136.65,71.63 141.22,71.63 RG12.1
  Bottom 0.406: v136.65,71.63 129.79,64.77 v125.48,64.77
GBH
  Top 0.406: 34.29,17.02 22.86,17.02 21.59,15.75 21.59,14.99 16.26,14.99 RG5.1 | 34.29,17.02 34.29,14.99 RG6.1 | 34.29,17.02 38.61,21.34 38.61,32.51 52.58,32.51 53.59,31.5 53.59,31.24 53.85,30.99 DRV2.8
GBH1  (via drill 0.61)
  Top 0.406: 113.03,17.02 101.6,17.02 100.33,15.75 100.33,14.99 95,14.99 RG13.1 | 113.03,17.02 113.03,14.99 RG14.1 | v136.4,23.37 136.4,23.88 135.89,24.38 DRV4.8 | v126.24,20.57 124.97,19.3 124.97,17.53 124.46,17.02 113.03,17.02
  Bottom 0.406: v136.4,23.37 133.6,20.57 v126.24,20.57
GBL  (via drill 0.61)
  Top 0.406: v60.2,14.99 55.63,14.99 RG7.1 | v71.63,17.02 73.66,14.99 RG8.1 | v43.43,24.64 43.43,27.69 44.96,29.21 DRV2.1
  Bottom 0.406: v71.63,17.02 62.23,17.02 v60.2,14.99 59.94,15.24 52.83,15.24 v43.43,24.64
GBL1  (via drill 0.61)
  Top 0.406: 132.72,15.62 127,21.34 127,24.38 DRV4.1 | 132.72,15.62 133.35,14.99 RG15.1 | v151.64,16 151.64,15.75 152.4,14.99 RG16.1 | 132.72,15.62 v134.11,17.02
  Bottom 0.406: v151.64,16 150.62,17.02 v134.11,17.02
GND  (via drill 0.61)
  Top 0.61: UTC.3 153.16,83.82 154.94,83.82 D5.A | DRV3.15 128.27,64.26 128.52,64.52 128.52,66.04 128.78,66.29 C18.- 130.81,66.29 130.81,64.26 DRV3.13 130.81,62.48 131.06,62.23 v131.06,57.66 | 140.97,53.34 140.97,54.1 140.21,54.86 U$5.4 | 140.97,53.34 140.97,52.83 149.86,43.94 149.86,2.79 151.89,2.79 UTD.3 | v149.1,61.21 141.22,53.34 140.97,53.34 | R6.1 16.51,19.81 16.51,19.3 16.76,19.05 19.05,19.05 19.05,30.73 19.01,30.94 | 19.01,30.94 R4.14 18.8,31.5 17.78,31.5 R4.13 17.53,31.5 16.51,31.5 R4.12 16.26,31.5 15.24,31.5 R4.11 14.99,31.5 13.97,31.5 R4.10 13.72,31.5 12.7,31.5 R4.9 | 19.01,30.94 19.3,30.99 20.07,30.99 R4.15 20.32,31.5 21.34,31.5 R4.16 21.59,32 v23.37,33.78 | SV1.9 7.62,46.99 7.62,52.07 SV1.15 | DRV1.15 18.03,63.25 18.03,65.28 C9.- | DRV1.13 20.32,63.25 20.07,63.5 20.07,64.52 19.3,65.28 C9.- | R8.2 5.08,23.37 5.08,20.83 C21.2 5.59,19.81 5.84,19.56 v5.84,18.8 | R4.9 12.45,30.73 12.45,21.08 R1.2 11.18,19.56 v10.41,18.8 | 10.92,45.72 10.92,33.53 12.45,32 R4.9 | 10.92,45.72 10.92,59.18 17.02,65.28 C9.- | 10.92,45.72 v10.67,45.72 | DRV4.15 128.27,36.07 128.27,38.1 C17.- | DRV4.13 130.56,36.07 130.3,36.32 130.3,37.59 129.79,38.1 C17.- | 125.35,42.29 120.14,47.5 109.22,47.5 109.22,49.28 C20.- C19.+ 102.87,49.28 102.87,41.91 95.5,34.54 U$3.4 93.98,26.92 96.52,24.38 96.52,22.86 95.76,22.1 80.77,22.1 | 125.35,42.29 127.51,40.13 C17.- | C16.- 46.48,42.67 46.48,40.89 DRV2.15 46.23,39.12 46.23,35.81 v29.72,35.81 | DRV2.13 48.77,40.89 48.51,41.15 48.51,41.91 47.75,42.67 C16.- | U$2.4 44.7,50.04 45.47,49.28 45.47,44.7 C16.- | 80.77,22.1 80.77,47.24 83.57,50.04 U$1.4 83.57,51.56 81.53,53.59
  Top 0.61: 80.77,22.1 80.77,2.79 73.66,2.79 UTB.3 | 81.53,53.59 81.53,84.07 74.42,84.07 UTA.3 | v81.28,53.59 81.53,53.59 | v125.73,54.36 125.48,54.1 125.48,42.42 125.35,42.29
  Bottom 0.61: U$5.4 138.68,55.88 132.84,55.88 v131.06,57.66 127.76,54.36 v125.73,54.36 | v149.1,61.21 154.18,61.21 D5.A | v5.84,18.8 v10.41,18.8 | v10.67,45.72 SV1.9 | v81.28,53.59 46.99,53.59 44.96,51.56 U$2.4 | v23.37,33.78 25.4,35.81 v29.72,35.81
HA  (via drill 0.61)
  Top 0.254: v16.51,36.58 17.53,37.59 R4.4 | v9.65,36.83 9.65,58.93 15.75,65.02 15.75,68.07 19.56,68.07 20.83,66.8 20.83,64.01 21.59,63.25 DRV1.12
  Bottom 0.254: v16.51,36.58 16.26,36.83 v9.65,36.83 5.08,36.83 SV1.4
HB  (via drill 0.61)
  Top 0.254: v18.03,39.62 18.8,38.86 R4.3 | v49.02,38.1 50.04,39.12 DRV2.12 | v36.32,39.37 35.56,39.37 34.8,40.13 v24.64,40.13
  Bottom 0.254: SV1.3 6.86,38.61 17.02,38.61 v18.03,39.62 18.29,39.88 24.38,39.88 v24.64,40.13 | v49.02,38.1 47.75,39.37 v36.32,39.37
HC  (via drill 0.61)
  Top 0.254: v15.49,39.62 16.26,38.86 R4.5 16.51,38.86 16.51,39.37 v19.05,41.91 | v126.49,69.09 131.32,69.09 131.57,68.83 131.57,64.52 131.83,64.26 DRV3.12 | v115.32,68.83 100.84,54.36 100.84,47.75 v95,41.91 | v36.32,41.91 29.97,41.91 29.46,42.42 v23.62,42.42
  Bottom 0.254: v15.49,39.62 14.48,40.64 SV1.5 | v126.49,69.09 126.24,68.83 v115.32,68.83 | v36.32,41.91 v95,41.91 | v23.62,42.42 23.11,41.91 v19.05,41.91
HD  (via drill 0.61)
  Top 0.254: v13.21,41.66 13.21,39.37 13.72,38.86 R4.7 | v131.32,37.08 131.32,36.58 131.83,36.07 DRV4.12 | v125.22,39.88 123.7,41.4 v104.39,41.4 | v36.32,40.64 29.46,40.64 v29.46,41.15
  Bottom 0.254: SV1.7 6.86,42.67 12.19,42.67 v13.21,41.66 15.24,43.69 26.92,43.69 26.92,40.89 27.43,40.39 28.7,40.39 v29.46,41.15 | v131.32,37.08 128.52,39.88 v125.22,39.88 | v104.39,41.4 102.87,39.88 37.08,39.88 v36.32,40.64
LA  (via drill 0.61)
  Top 0.254: v17.02,34.54 20.07,37.59 R4.2 | v17.27,59.69 19.05,61.47 DRV1.14 | v2.54,32.51 3.56,33.53 3.56,35.05 SV1.2
  Bottom 0.254: v17.02,34.54 16.76,34.29 5.08,34.29 SV1.2 | v17.27,59.69 3.3,59.69 1.52,57.91 1.52,32.51 v2.54,32.51
LB  (via drill 0.61)
  Top 0.254: v19.3,35.56 21.34,37.59 R4.1 | v47.24,38.1 47.24,38.86 47.5,39.12 DRV2.14 | v36.32,38.1 35.31,38.1 34.8,37.59 v24.64,37.59
  Bottom 0.254: SV1.1 v19.3,35.56 19.56,35.81 22.86,35.81 v24.64,37.59 | v36.32,38.1 v47.24,38.1
LC  (via drill 0.61)
  Top 0.254: R4.6 14.99,38.86 v14.22,39.62 14.48,39.88 14.48,40.64 16.51,40.64 21.59,45.72 21.59,45.97 22.35,45.97 23.11,45.21 34.29,45.21 v38.61,40.89 | v127,59.44 127,60.2 129.29,62.48 DRV3.14 | v123.95,58.17 120.9,55.12 109.98,55.12 109.98,48.77 v110.24,48.51
  Bottom 0.254: v14.22,39.62 13.97,39.37 5.08,39.37 SV1.6 | v127,59.44 125.73,58.17 v123.95,58.17 | v110.24,48.51 102.62,40.89 v38.61,40.89
LD  (via drill 0.61)
  Top 0.254: v11.94,41.66 11.94,39.37 12.45,38.86 R4.8 12.7,37.59 v17.02,33.27 | v95,29.97 124.97,29.97 129.29,34.29 DRV4.14 | v36.32,29.72 34.8,31.24 v24.64,31.24
  Bottom 0.254: v11.94,41.66 11.68,41.91 5.08,41.91 SV1.8 | v95,29.97 94.74,29.72 v36.32,29.72 | v24.64,31.24 23.88,32 18.29,32 v17.02,33.27
LMIS  (via drill 0.61)
  Top 0.254: v26.67,46.99 29.21,46.99 31.24,49.02 v37.59,49.02 | v85.09,48.51 86.11,49.53 86.11,50.04 U$1.3
  Bottom 0.254: v26.67,46.99 25.65,48.01 17.53,48.01 16.51,46.99 5.08,46.99 SV1.12 | v37.59,49.02 38.1,48.51 v85.09,48.51
MA1  (via drill 0.81)
  Top 0.61: CB3.2 133.86,50.04 133.35,50.55 133.35,52.58 DRV3.6 133.35,54.36 v133.35,57.15 | v138.18,59.18 146.56,67.56 146.56,70.36 MC3.1
  Top 3.81: MC1.1 QCH1.S 113.54,83.31 94.49,83.31 | MC2.1 QCH2.S 94.49,83.31 | 147.32,83.31 QCL1.D MC3.1 | 94.49,83.31 147.32,83.31 | MC4.1 QCL2.D 128.27,83.31 147.32,83.31
  Bottom 0.61: v133.35,57.15 135.38,59.18 v138.18,59.18
  Bottom 0.813: MC1.1 113.03,73.15 | R5.1 115.57,64.01 110.74,64.01 105.16,69.6 98.04,69.6 MC2.1
MB
  Top 0.61: DRV2.6 51.56,29.21 51.56,27.18 52.07,26.67 CB2.2 52.07,25.65 50.29,23.88 50.29,16.26 MB3.1
  Top 3.81: MB1.1 4.57,3.3 23.62,3.3 | 23.62,3.3 MB2.1 | 49.53,3.3 MB3.1 | 23.62,3.3 49.53,3.3 | MB4.1 68.58,3.3 49.53,3.3
  Bottom 0.813: MB2.1 24.13,13.46 26.67,16 C1.2
  Bottom 3.81: MB1.1 QBH1.S | 23.62,8.64 QBH2.S MB2.1 | 49.53,8.64 QBL1.D MB3.1 | 68.58,8.64 QBL2.D MB4.1
MB1
  Top 0.61: DRV4.6 133.35,24.38 133.35,22.35 133.86,21.84 CB4.2 134.62,20.83 134.62,19.81 135.13,19.3 135.13,17.27 136.14,16.26 136.14,3.3
  Top 3.81: MD1.1 QDH1.S 102.36,3.3 83.31,3.3 | 83.31,3.3 QDH2.S MD2.1 | MD3.1 QDL1.D 147.32,3.3 136.14,3.3 | 83.31,3.3 136.14,3.3 | 128.27,8.64 128.27,3.3 136.14,3.3 | 128.27,8.64 QDL2.D | 128.27,8.64 MD4.1
  Bottom 0.813: MD1.1 102.87,13.46 109.22,19.81 C8.2
  Bottom 3.81: MD2.1 83.31,8.89 | MD1.1 102.36,8.89 | 128.27,8.64 QDL2.D MD4.1 | MD3.1 147.32,8.89
N$1
  Top 0.61: DB3.C 137.16,19.05 137.67,19.56 137.67,47.75 136.4,49.02 CB3.1 135.64,50.04 135.64,50.55 134.87,51.31 134.87,52.32 134.62,52.58 DRV3.7
N$2
  Bottom 0.813: R3.2 27.94,27.43 C1.1
N$3  (via drill 0.61)
  Top 0.61: CB4.1 135.64,21.84 135.64,22.61 134.62,23.62 134.62,24.38 DRV4.7 134.37,26.16 134.37,26.42 v133.6,27.18 | v131.83,40.89 131.83,45.97 DB4.C
  Bottom 0.61: v131.83,40.89 131.83,38.1 133.6,36.32 v133.6,27.18
N$4
  Bottom 0.813: C8.1 114.3,26.16 R5.2
N$5  (via drill 0.61)
  Top 0.61: v17.02,50.04 17.02,49.28 16.76,49.02 DB1.C | DRV1.7 24.13,51.56 v24.13,50.29 24.38,50.55 25.4,49.53 25.4,49.02 CB1.1
  Bottom 0.61: v17.02,50.04 17.27,50.29 v24.13,50.29
N$6  (via drill 0.61)
  Top 0.254: 150.62,19.56 150.62,54.1 150.37,54.36 150.37,80.77 151.64,82.04 UTC.1 | 150.62,19.56 150.62,7.62 152.15,6.1 152.15,5.59 152.65,5.08 UTD.1 | C21.1 3.56,20.83 v3.56,22.35 3.56,23.37 R8.1 | v8.64,22.35 8.64,22.86 9.14,23.37 R7.1 | UTB.1 74.68,5.08 76.45,6.86 v76.45,25.65 76.45,78.99 73.66,81.79 UTA.1 | v28.7,24.64 v37.59,24.64 | v150.88,19.56 150.62,19.56 | v116.08,19.56 v123.95,19.56
  Bottom 0.254: v3.56,22.35 v8.64,22.35 10.92,24.64 v28.7,24.64 | v37.59,24.64 38.61,25.65 v76.45,25.65 76.71,25.4 110.24,25.4 v116.08,19.56 | v123.95,19.56 v150.88,19.56
N$7
  Top 1.016: R10.2 155.19,27.18 155.7,27.69 155.7,29.21 R9.1
N$8
  Top 1.016: D3.C 160.53,37.59 156.72,41.4 156.72,46.99 R9.2
  Bottom 1.016: R9.2 160.78,50.55 D4.C
N$9  (via drill 0.61)
  Top 0.61: v45.21,24.64 45.21,25.65 DB2.C | v53.34,24.64 53.85,25.15 53.85,25.65 CB2.1 53.85,26.67 53.85,27.18 53.09,27.94 53.09,28.96 52.83,29.21 DRV2.7
  Bottom 0.61: v45.21,24.64 v53.34,24.64
N$10
  Top 1.016: R10.1 160.02,18.8 X1.5
Q1G
  Top 0.406: RG1.2 QAH1.G
Q1G1
  Top 0.406: RG10.2 QCH1.G
Q2G
  Top 0.406: RG2.2 Q2.G
Q2G1
  Top 0.406: RG9.2 QCH2.G
Q3G
  Top 0.406: RG3.2 QAL1.G
Q3G1
  Top 0.406: RG12.2 QCL1.G
Q4G
  Top 0.406: RG4.2 QAL2.G
Q4G1
  Top 0.406: RG11.2 QCL2.G
Q5G
  Top 0.406: QBH1.G RG5.2
Q5G1
  Top 0.406: QDH1.G RG14.2
Q6G
  Top 0.406: QBH2.G RG6.2
Q6G1
  Top 0.406: QDH2.G RG13.2
Q7G
  Top 0.406: QBL1.G RG7.2
Q7G1
  Top 0.406: QDL1.G RG16.2
Q8G
  Top 0.406: QBL2.G RG8.2
Q8G1
  Top 0.406: QDL2.G RG15.2
QAH2  (via drill 0.61)
  Top 0.254: CB1.2 23.62,49.02 23.11,49.53 23.11,51.56 DRV1.6 23.11,53.34 v24.38,54.61 | MA1.1 QAH1.S | Q2.S MA2.1 | QAL1.D MA3.1 | QAL2.D MA4.1
  Top 3.81: 34.8,83.31 Q2.S | 49.53,83.31 QAL1.D | 34.8,83.31 49.53,83.31 | QAL2.D 68.58,83.31 49.53,83.31 | QAH1.S 15.75,83.31 34.8,83.31
  Bottom 0.254: 27.94,54.61 v24.38,54.61
  Bottom 0.813: R3.1 27.94,54.61 27.94,65.53 20.32,73.15 MA1.1 15.24,73.15
RMIS  (via drill 0.61)
  Top 0.254: v26.67,51.31 40.39,51.31 41.4,52.32 46.48,52.32 46.48,51.56 U$2.3
  Bottom 0.254: v26.67,51.31 13.97,51.31 13.46,50.8 SV1.13
TEMPA  (via drill 0.61)
  Top 0.254: v46.48,69.6 46.48,68.83 68.58,68.83 70.87,71.12 70.87,83.31 74.17,83.31 74.68,82.8 UTA.2 | v32,80.52 18.03,80.52 18.03,71.12 14.48,67.56 2.54,67.56 2.54,57.15 SV1.18
  Bottom 0.254: v46.48,69.6 35.56,80.52 v32,80.52
TEMPB  (via drill 0.61)
  Top 0.254: v23.62,40.89 23.62,34.8 52.58,34.8 70.87,16.51 70.87,6.35 72.14,5.08 UTB.2 | v14.99,41.91 11.94,44.96 v11.94,51.82
  Bottom 0.254: v23.62,40.89 16,40.89 v14.99,41.91 | v11.94,51.82 8.38,55.37 6.86,55.37 SV1.17
TEMPC  (via drill 0.61)
  Top 0.254: v151.38,54.61 150.88,55.12 150.88,80.52 152.4,80.52 153.42,81.53 UTC.2 | v116.33,32.26 v123.95,39.88 | v36.32,32.77 23.62,32.77 23.62,18.54 22.86,17.78 14.22,17.78 14.22,17.27 13.97,17.02 6.86,17.02 6.86,33.27 5.08,35.05 5.08,57.15 SV1.20
  Bottom 0.254: v151.38,54.61 138.68,41.91 125.98,41.91 v123.95,39.88 | v116.33,32.26 75.69,32.26 75.18,32.77 v36.32,32.77
TEMPD  (via drill 0.61)
  Top 0.254: v151.13,5.84 151.13,5.08 UTD.2 | v84.84,18.03 v123.95,18.03 | v61.47,24.64 52.32,33.78 v28.7,33.78
  Bottom 0.254: v151.13,5.84 151.13,14.99 152.65,14.99 153.42,15.75 153.42,18.03 v123.95,18.03 | v84.84,18.03 78.23,24.64 v61.47,24.64 | v28.7,33.78 25.15,30.23 7.37,30.23 2.03,35.56 2.03,57.15 5.08,57.15 SV1.19
VBATSENSE  (via drill 0.61)
  Top 0.254: R6.2 17.27,20.83 17.27,21.34 16.76,21.84 16.76,23.62 R2.1 15.75,23.62 13.72,21.59 13.72,17.78 9.14,17.78 7.62,19.3 7.62,22.61 8.38,23.37 8.38,51.82 v8.64,52.07
  Bottom 0.254: v8.64,52.07 5.08,52.07 SV1.16
VCC  (via drill 0.61)
  Top 0.61: DB1.A 13.97,48.01 13.97,45.47 14.48,44.96 19.81,44.96 19.81,46.99 20.32,47.5 20.32,48.01 CVCC1.1 | DRV1.3 19.3,51.56 19.56,51.31 19.56,50.29 20.32,49.53 20.32,49.02 CVCC1.1 | DB2.A 42.42,26.67 42.67,26.92 42.67,29.97 44.45,31.75 47.5,31.75 47.5,30.99 DRV2.3 47.75,29.21 47.75,28.96 48.77,27.94 | 48.77,27.94 48.77,26.67 CVCC2.1 | DB4.A 129.03,46.99 130.56,48.51 130.56,49.02 CVCC3.1 | DRV3.3 129.54,52.58 129.79,52.32 129.79,51.31 130.56,50.55 130.56,50.04 CVCC3.1 | DB3.A 133.1,19.05 131.32,20.83 CVCC4.1 130.56,21.84 130.56,22.35 129.79,23.11 129.79,24.13 129.54,24.38 DRV4.3 129.54,26.16 129.54,26.42 131.7,28.57 | 131.7,28.57 136.65,33.53 136.65,44.96 135.38,44.96 131.32,49.02 CVCC3.1 | v117.35,28.7 131.57,28.7 131.7,28.57 | v50.55,27.94 48.77,27.94 | v44.45,45.97 24.13,45.97 22.86,47.24 22.86,48.01 21.08,48.01 CVCC1.1 | v53.59,42.93 59.94,36.58 v59.94,28.7
  Bottom 0.61: v50.55,27.94 51.31,28.7 v59.94,28.7 v117.35,28.7 | v44.45,45.97 47.5,42.93 v53.59,42.93